# Altium schematic sheet QCLogic Rev A Sht8 MCU Power.SchDoc
size A4
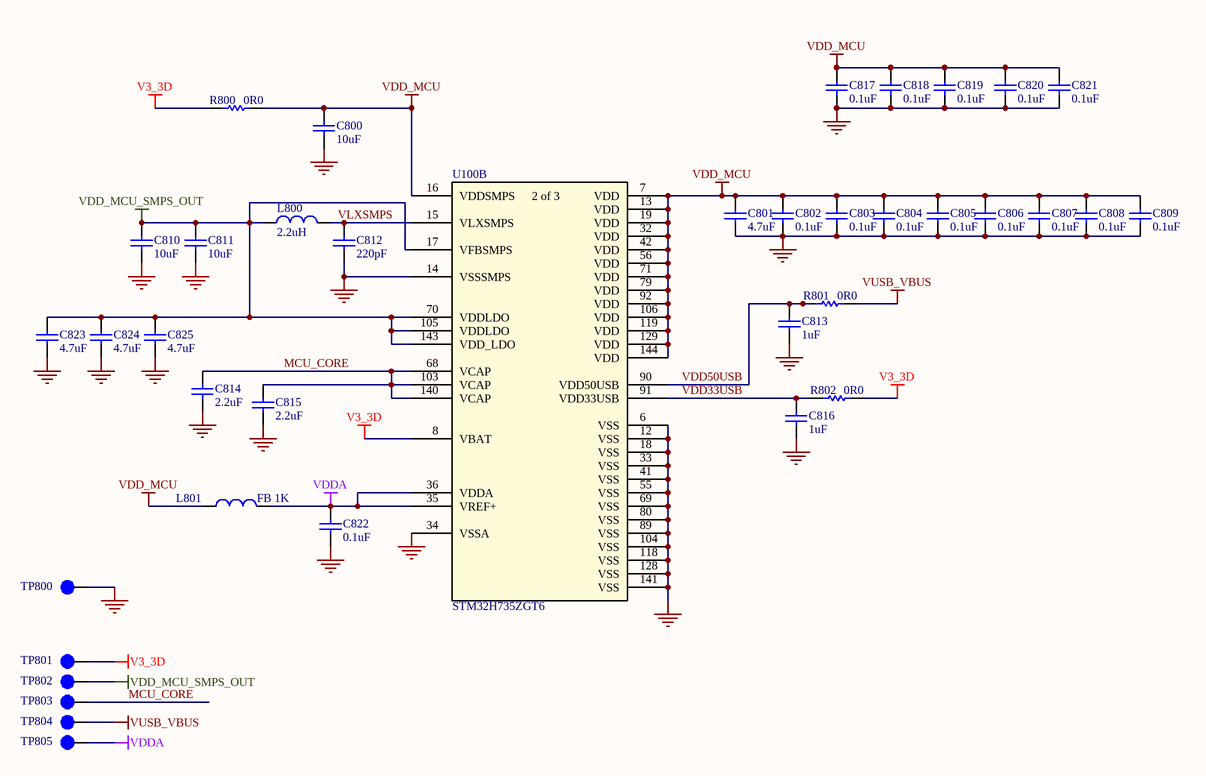
[diagram p0: QCLogic Rev A Sht8 MCU Power.SchDoc]

## Parts
C800  10uF  [SMD CAP 0805]
C801  4.7uF  [SMD CAP 0603]
C802  0.1uF  [SMD CAP 0402]
C803  0.1uF  [SMD CAP 0402]
C804  0.1uF  [SMD CAP 0402]
C805  0.1uF  [SMD CAP 0402]
C806  0.1uF  [SMD CAP 0402]
C807  0.1uF  [SMD CAP 0402]
C808  0.1uF  [SMD CAP 0402]
C809  0.1uF  [SMD CAP 0402]
C810  10uF  [SMD CAP 0805]
C811  10uF  [SMD CAP 0805]
C812  220pF  [SMD CAP 0402]
C813  1uF  [SMD CAP 0402]
C814  2.2uF  [SMD CAP 0402]
C815  2.2uF  [SMD CAP 0402]
C816  1uF  [SMD CAP 0402]
C817  0.1uF  [SMD CAP 0402]
C818  0.1uF  [SMD CAP 0402]
C819  0.1uF  [SMD CAP 0402]
C820  0.1uF  [SMD CAP 0402]
C821  0.1uF  [SMD CAP 0402]
C822  0.1uF  [SMD CAP 0402]
C823  4.7uF  [SMD CAP 0603]
C824  4.7uF  [SMD CAP 0603]
C825  4.7uF  [SMD CAP 0603]
L800  2.2uH  [IND SMD 0806]
L801  FB 1K  [SMD RES 0402]
R800  0R0  [SMD RES 0402]
R801  0R0  [SMD RES 0402]
R802  0R0  [SMD RES 0402]
TP800  TESTPOINT SMD  [TESTPOINT 1mm DIA]  (value not drawn)  (no BOM)
TP801  TESTPOINT SMD  [TESTPOINT 0.5mm DIA]  (value not drawn)  (no BOM)
TP802  TESTPOINT SMD  [TESTPOINT 0.5mm DIA]  (value not drawn)  (no BOM)
TP803  TESTPOINT SMD  [TESTPOINT 0.5mm DIA]  (value not drawn)  (no BOM)
TP804  TESTPOINT SMD  [TESTPOINT 0.5mm DIA]  (value not drawn)  (no BOM)
TP805  TESTPOINT SMD  [TESTPOINT 0.5mm DIA]  (value not drawn)  (no BOM)
U100  STM32H735ZGT6  [LQFP-144 20x20]  (part B of 3)

## Nets
GND: C800.2 C801.2 C802.1 C803.1 C804.1 C805.1 C806.1 C807.1 C808.1 C809.1 C810.2 C811.2 C812.1 C813.2 C814.1 C815.1 C816.2 C817.1 C818.1 C819.1 C820.1 C821.1 C822.1 C823.2 C824.2 C825.2 TP800.1 U100.6(VSS) U100.12(VSS) U100.14(VSSSMPS) U100.18(VSS) U100.33(VSS) U100.34(VSSA) U100.41(VSS) U100.55(VSS) U100.69(VSS) U100.80(VSS) U100.89(VSS) U100.104(VSS) U100.118(VSS) U100.128(VSS) U100.141(VSS)
V3_3D: R800.1 R802.2 TP801.1 U100.8(VBAT)
VDD_MCU: C800.1 C801.1 C802.2 C803.2 C804.2 C805.2 C806.2 C807.2 C808.2 C809.2 C817.2 C818.2 C819.2 C820.2 C821.2 L801.1 R800.2 U100.7(VDD) U100.13(VDD) U100.16(VDDSMPS) U100.19(VDD) U100.32(VDD) U100.42(VDD) U100.56(VDD) U100.71(VDD) U100.79(VDD) U100.92(VDD) U100.106(VDD) U100.119(VDD) U100.129(VDD) U100.144(VDD)
VDD_MCU_SMPS_OUT: C810.1 C811.1 C823.1 C824.1 C825.1 L800.1 TP802.1 U100.17(VFBSMPS) U100.70(VDDLDO) U100.105(VDDLDO) U100.143(VDD_LDO)
VDDA: C822.2 L801.2 TP805.1 U100.35(VREF+) U100.36(VDDA)
VUSB_VBUS: R801.2 TP804.1
MCU_CORE: C814.2 C815.2 TP803.1 U100.68(VCAP) U100.103(VCAP) U100.140(VCAP)
VDD33USB: C816.1 R802.1 U100.91(VDD33USB)
VDD50USB: C813.1 R801.1 U100.90(VDD50USB)
VLXSMPS: C812.2 L800.2 U100.15(VLXSMPS)

## Notes on the sheet
- (in symbol IC MCU STM32H735ZG Arm M7, part B) 2 of 3

## Library data of the parts
C800 C810 C811 = CAP MLCC SMD: CAP CER 10UF 25V X5R 0805; 1. Manufacturer: Taiyo Yuden; 2. Manufacturer Part Number: TMK212BBJ106KG-T; 4. Package: 0805; 3. Date Modified: 20201128
C801 C823-C825 = CAP MLCC SMD: CAP CER 4.7UF 16V X7S 0603; 1. Manufacturer: Murata Electronics; 2. Manufacturer Part Number: GRM188C71C475KE21D; 4. Package: 0603; 3. Date Modified: 20200906
C802-C809 C817-C822 = CAP MLCC SMD: CAP CER 0.1UF 25V X7R 0402; 1. Manufacturer: Yageo; 2. Manufacturer Part Number: CC0402KRX7R8BB104; 4. Package: 0402; 3. Date Modified: 20201122
C812 = CAP MLCC SMD: CAP CER 220PF 50V X7R 0402; 1. Manufacturer: Yageo; 2. Manufacturer Part Number: CC0402KRX7R9BB221; 4. Package: 0402; 3. Date Modified: 20201125
C813 C816 = CAP MLCC SMD: CAP CER 1UF 25V X5R 0402; 1. Manufacturer: Murata Electronics; 2. Manufacturer Part Number: GRT155R61E105KE01D; 4. Package: 0402; 3. Date Modified: 20200805
C814 C815 = CAP MLCC SMD: CAP CER 2.2UF 16V X6S 0402; 1. Manufacturer: Murata Electronics; 2. Manufacturer Part Number: GRM155C81C225ME15D; 4. Package: 0402; 3. Date Modified: 20200914
L800 = INDUCTOR: IND FIXED 2.2UH 1.2A 138 MOHM; 1. Manufacturer: Murata Electronics; 2. Manufacturer Part Number: LQM2MPN2R2NG0L; 3. Date Modified: 20201125
L801 = INDUCTOR: FERRITE BEAD 1 KOHM 0402 1LN; 1. Manufacturer: Murata Electronics; 2. Manufacturer Part Number: BLM15HD102SN1D; 3. Date Modified: 20201122
R800-R802 = RES SMD: RES SMD 0 OHM JUMPER 1/16W 0402; 1. Manufacturer: Yageo; 2. Manufacturer Part Number: RC0402FR-070RL; 4. Package: 0402; 3. Date Modified: 20201122
TP800-TP805 = TESTPOINT PAD: TESTPOINT SMD PAD; 1. Manufacturer: *; 2. Manufacturer Part Number: *; 3. Date Modified: *
U100 = IC MCU STM32H735ZG Arm M7: ARM® Cortex®-M7 STM32H7 Microcontroller IC 32-Bit 550MHz 1MB (1M x 8) FLASH 144 LQFP 20x20; 1. Manufacturer: STMicroelectronics; 2. Manufacturer Part Number: STM32H735ZGT6; 3. Date Modified: 20201126